# Altium schematic sheet JETSON AGX NVHS.SchDoc: Jetson AGX -NVHS
size 431 x 279 mm; CheckedBy: Lance Bantoto; DocumentNumber: 5; Revision: 1; SheetNumber: 5; SheetTotal: 23
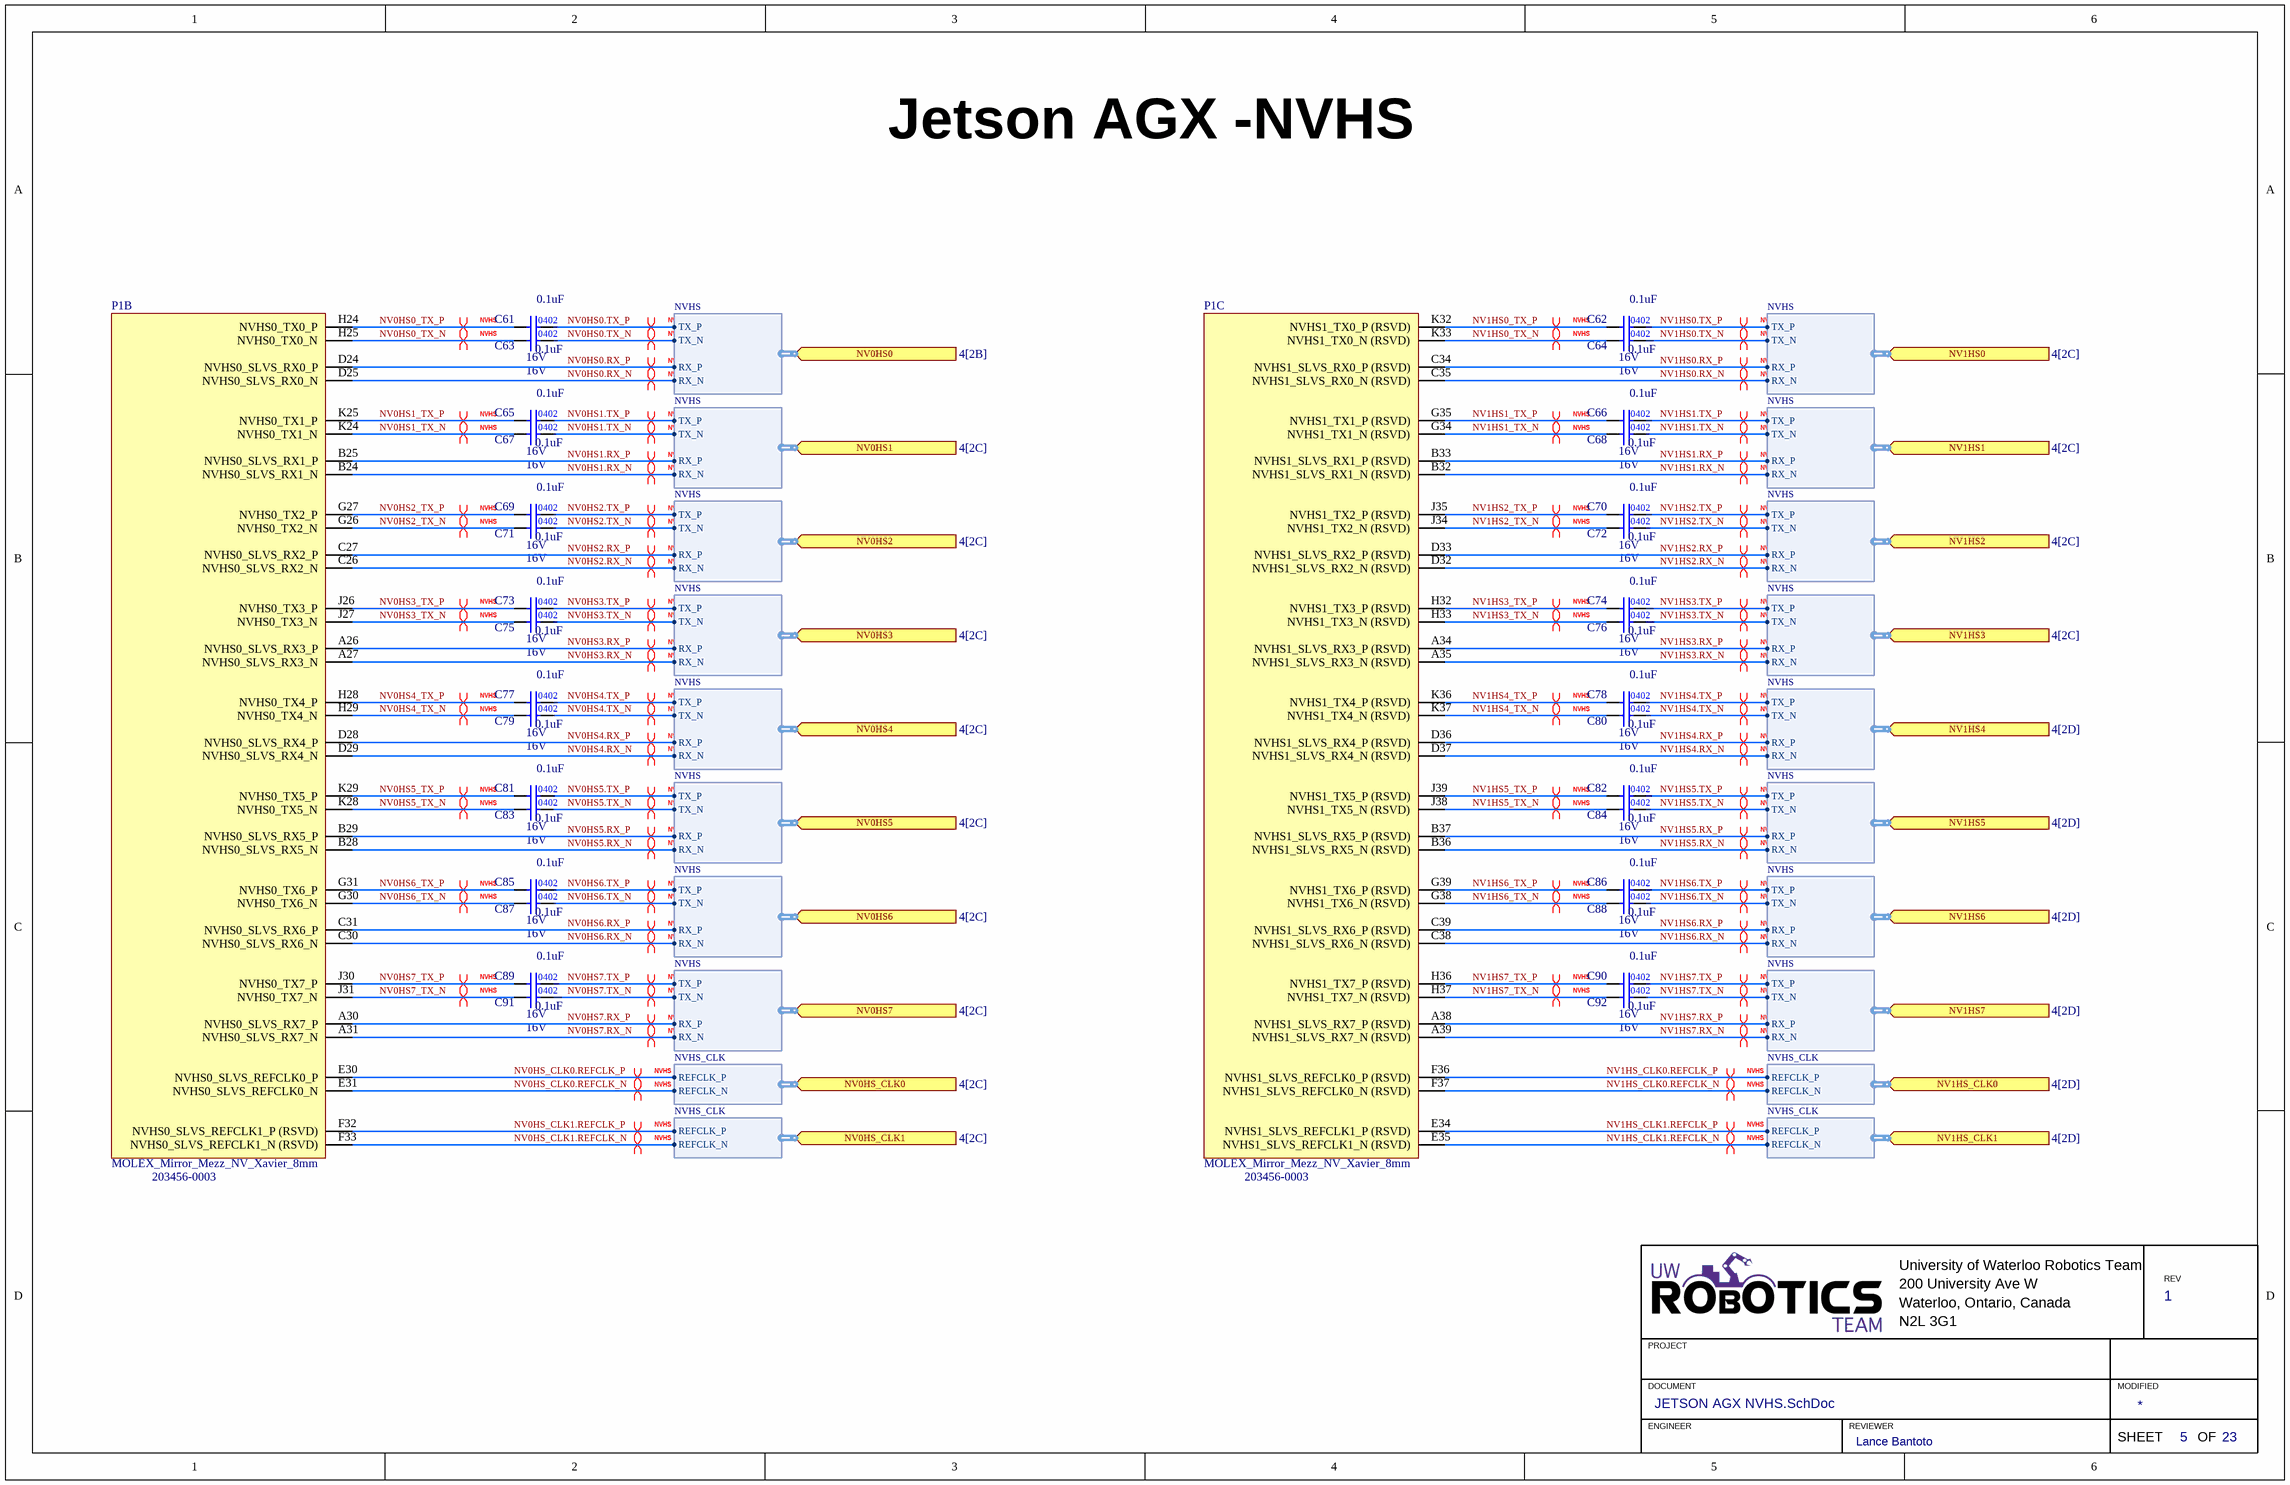
[diagram p0: JETSON AGX NVHS.SchDoc]

## Parts
C61  Capacitance: 0.1uF  Voltage Rating: 16V  [CAP0402]  (hidden comment: CAP_0.1uF_16V_X7R_0402)
C62  Capacitance: 0.1uF  Voltage Rating: 16V  [CAP0402]  (hidden comment: CAP_0.1uF_16V_X7R_0402)
C63  Capacitance: 0.1uF  Voltage Rating: 16V  [CAP0402]  (hidden comment: CAP_0.1uF_16V_X7R_0402)
C64  Capacitance: 0.1uF  Voltage Rating: 16V  [CAP0402]  (hidden comment: CAP_0.1uF_16V_X7R_0402)
C65  Capacitance: 0.1uF  Voltage Rating: 16V  [CAP0402]  (hidden comment: CAP_0.1uF_16V_X7R_0402)
C66  Capacitance: 0.1uF  Voltage Rating: 16V  [CAP0402]  (hidden comment: CAP_0.1uF_16V_X7R_0402)
C67  Capacitance: 0.1uF  Voltage Rating: 16V  [CAP0402]  (hidden comment: CAP_0.1uF_16V_X7R_0402)
C68  Capacitance: 0.1uF  Voltage Rating: 16V  [CAP0402]  (hidden comment: CAP_0.1uF_16V_X7R_0402)
C69  Capacitance: 0.1uF  Voltage Rating: 16V  [CAP0402]  (hidden comment: CAP_0.1uF_16V_X7R_0402)
C70  Capacitance: 0.1uF  Voltage Rating: 16V  [CAP0402]  (hidden comment: CAP_0.1uF_16V_X7R_0402)
C71  Capacitance: 0.1uF  Voltage Rating: 16V  [CAP0402]  (hidden comment: CAP_0.1uF_16V_X7R_0402)
C72  Capacitance: 0.1uF  Voltage Rating: 16V  [CAP0402]  (hidden comment: CAP_0.1uF_16V_X7R_0402)
C73  Capacitance: 0.1uF  Voltage Rating: 16V  [CAP0402]  (hidden comment: CAP_0.1uF_16V_X7R_0402)
C74  Capacitance: 0.1uF  Voltage Rating: 16V  [CAP0402]  (hidden comment: CAP_0.1uF_16V_X7R_0402)
C75  Capacitance: 0.1uF  Voltage Rating: 16V  [CAP0402]  (hidden comment: CAP_0.1uF_16V_X7R_0402)
C76  Capacitance: 0.1uF  Voltage Rating: 16V  [CAP0402]  (hidden comment: CAP_0.1uF_16V_X7R_0402)
C77  Capacitance: 0.1uF  Voltage Rating: 16V  [CAP0402]  (hidden comment: CAP_0.1uF_16V_X7R_0402)
C78  Capacitance: 0.1uF  Voltage Rating: 16V  [CAP0402]  (hidden comment: CAP_0.1uF_16V_X7R_0402)
C79  Capacitance: 0.1uF  Voltage Rating: 16V  [CAP0402]  (hidden comment: CAP_0.1uF_16V_X7R_0402)
C80  Capacitance: 0.1uF  Voltage Rating: 16V  [CAP0402]  (hidden comment: CAP_0.1uF_16V_X7R_0402)
C81  Capacitance: 0.1uF  Voltage Rating: 16V  [CAP0402]  (hidden comment: CAP_0.1uF_16V_X7R_0402)
C82  Capacitance: 0.1uF  Voltage Rating: 16V  [CAP0402]  (hidden comment: CAP_0.1uF_16V_X7R_0402)
C83  Capacitance: 0.1uF  Voltage Rating: 16V  [CAP0402]  (hidden comment: CAP_0.1uF_16V_X7R_0402)
C84  Capacitance: 0.1uF  Voltage Rating: 16V  [CAP0402]  (hidden comment: CAP_0.1uF_16V_X7R_0402)
C85  Capacitance: 0.1uF  Voltage Rating: 16V  [CAP0402]  (hidden comment: CAP_0.1uF_16V_X7R_0402)
C86  Capacitance: 0.1uF  Voltage Rating: 16V  [CAP0402]  (hidden comment: CAP_0.1uF_16V_X7R_0402)
C87  Capacitance: 0.1uF  Voltage Rating: 16V  [CAP0402]  (hidden comment: CAP_0.1uF_16V_X7R_0402)
C88  Capacitance: 0.1uF  Voltage Rating: 16V  [CAP0402]  (hidden comment: CAP_0.1uF_16V_X7R_0402)
C89  Capacitance: 0.1uF  Voltage Rating: 16V  [CAP0402]  (hidden comment: CAP_0.1uF_16V_X7R_0402)
C90  Capacitance: 0.1uF  Voltage Rating: 16V  [CAP0402]  (hidden comment: CAP_0.1uF_16V_X7R_0402)
C91  Capacitance: 0.1uF  Voltage Rating: 16V  [CAP0402]  (hidden comment: CAP_0.1uF_16V_X7R_0402)
C92  Capacitance: 0.1uF  Voltage Rating: 16V  [CAP0402]  (hidden comment: CAP_0.1uF_16V_X7R_0402)
P1  MOLEX_Mirror_Mezz_NV_Xavier_8mm  [203456-0003]  (parts B,C of 15)

## Ports
NV0HS0 (in, harness NVHS, see 4[2B]), NV0HS1 (in, harness NVHS, see 4[2C]), NV0HS2 (in, harness NVHS, see 4[2C]), NV0HS3 (in, harness NVHS, see 4[2C]), NV0HS4 (in, harness NVHS, see 4[2C]), NV0HS5 (in, harness NVHS, see 4[2C]), NV0HS6 (in, harness NVHS, see 4[2C]), NV0HS7 (in, harness NVHS, see 4[2C]), NV0HS_CLK0 (in, harness NVHS_CLK, see 4[2C]), NV0HS_CLK1 (in, harness NVHS_CLK, see 4[2C]), NV1HS0 (in, harness NVHS, see 4[2C]), NV1HS1 (in, harness NVHS, see 4[2C]), NV1HS2 (in, harness NVHS, see 4[2C]), NV1HS3 (in, harness NVHS, see 4[2C]), NV1HS4 (in, harness NVHS, see 4[2D]), NV1HS5 (in, harness NVHS, see 4[2D]), NV1HS6 (in, harness NVHS, see 4[2D]), NV1HS7 (in, harness NVHS, see 4[2D]), NV1HS_CLK0 (in, harness NVHS_CLK, see 4[2D]), NV1HS_CLK1 (in, harness NVHS_CLK, see 4[2D])

## Harnesses
NVHS: TX_P, TX_N, RX_P, RX_N
NVHS_CLK: REFCLK_P, REFCLK_N

## Nets
NV0HS0.RX_N: P1.D25(NVHS0_SLVS_RX0_N) ; port NV0HS0.RX_N
NV0HS0.RX_P: P1.D24(NVHS0_SLVS_RX0_P) ; port NV0HS0.RX_P
NV0HS0.TX_N: C63.2 ; port NV0HS0.TX_N
NV0HS0.TX_P: C61.2 ; port NV0HS0.TX_P
NV0HS0_TX_N: C63.1 P1.H25(NVHS0_TX0_N)
NV0HS0_TX_P: C61.1 P1.H24(NVHS0_TX0_P)
NV0HS1.RX_N: P1.B24(NVHS0_SLVS_RX1_N) ; port NV0HS1.RX_N
NV0HS1.RX_P: P1.B25(NVHS0_SLVS_RX1_P) ; port NV0HS1.RX_P
NV0HS1.TX_N: C67.2 ; port NV0HS1.TX_N
NV0HS1.TX_P: C65.2 ; port NV0HS1.TX_P
NV0HS1_TX_N: C67.1 P1.K24(NVHS0_TX1_N)
NV0HS1_TX_P: C65.1 P1.K25(NVHS0_TX1_P)
NV0HS2.RX_N: P1.C26(NVHS0_SLVS_RX2_N) ; port NV0HS2.RX_N
NV0HS2.RX_P: P1.C27(NVHS0_SLVS_RX2_P) ; port NV0HS2.RX_P
NV0HS2.TX_N: C71.2 ; port NV0HS2.TX_N
NV0HS2.TX_P: C69.2 ; port NV0HS2.TX_P
NV0HS2_TX_N: C71.1 P1.G26(NVHS0_TX2_N)
NV0HS2_TX_P: C69.1 P1.G27(NVHS0_TX2_P)
NV0HS3.RX_N: P1.A27(NVHS0_SLVS_RX3_N) ; port NV0HS3.RX_N
NV0HS3.RX_P: P1.A26(NVHS0_SLVS_RX3_P) ; port NV0HS3.RX_P
NV0HS3.TX_N: C75.2 ; port NV0HS3.TX_N
NV0HS3.TX_P: C73.2 ; port NV0HS3.TX_P
NV0HS3_TX_N: C75.1 P1.J27(NVHS0_TX3_N)
NV0HS3_TX_P: C73.1 P1.J26(NVHS0_TX3_P)
NV0HS4.RX_N: P1.D29(NVHS0_SLVS_RX4_N) ; port NV0HS4.RX_N
NV0HS4.RX_P: P1.D28(NVHS0_SLVS_RX4_P) ; port NV0HS4.RX_P
NV0HS4.TX_N: C79.2 ; port NV0HS4.TX_N
NV0HS4.TX_P: C77.2 ; port NV0HS4.TX_P
NV0HS4_TX_N: C79.1 P1.H29(NVHS0_TX4_N)
NV0HS4_TX_P: C77.1 P1.H28(NVHS0_TX4_P)
NV0HS5.RX_N: P1.B28(NVHS0_SLVS_RX5_N) ; port NV0HS5.RX_N
NV0HS5.RX_P: P1.B29(NVHS0_SLVS_RX5_P) ; port NV0HS5.RX_P
NV0HS5.TX_N: C83.2 ; port NV0HS5.TX_N
NV0HS5.TX_P: C81.2 ; port NV0HS5.TX_P
NV0HS5_TX_N: C83.1 P1.K28(NVHS0_TX5_N)
NV0HS5_TX_P: C81.1 P1.K29(NVHS0_TX5_P)
NV0HS6.RX_N: P1.C30(NVHS0_SLVS_RX6_N) ; port NV0HS6.RX_N
NV0HS6.RX_P: P1.C31(NVHS0_SLVS_RX6_P) ; port NV0HS6.RX_P
NV0HS6.TX_N: C87.2 ; port NV0HS6.TX_N
NV0HS6.TX_P: C85.2 ; port NV0HS6.TX_P
NV0HS6_TX_N: C87.1 P1.G30(NVHS0_TX6_N)
NV0HS6_TX_P: C85.1 P1.G31(NVHS0_TX6_P)
NV0HS7.RX_N: P1.A31(NVHS0_SLVS_RX7_N) ; port NV0HS7.RX_N
NV0HS7.RX_P: P1.A30(NVHS0_SLVS_RX7_P) ; port NV0HS7.RX_P
NV0HS7.TX_N: C91.2 ; port NV0HS7.TX_N
NV0HS7.TX_P: C89.2 ; port NV0HS7.TX_P
NV0HS7_TX_N: C91.1 P1.J31(NVHS0_TX7_N)
NV0HS7_TX_P: C89.1 P1.J30(NVHS0_TX7_P)
NV0HS_CLK0.REFCLK_N: P1.E31(NVHS0_SLVS_REFCLK0_N) ; port NV0HS_CLK0.REFCLK_N
NV0HS_CLK0.REFCLK_P: P1.E30(NVHS0_SLVS_REFCLK0_P) ; port NV0HS_CLK0.REFCLK_P
NV0HS_CLK1.REFCLK_N: P1.F33(NVHS0_SLVS_REFCLK1_N_(RSVD)) ; port NV0HS_CLK1.REFCLK_N
NV0HS_CLK1.REFCLK_P: P1.F32(NVHS0_SLVS_REFCLK1_P_(RSVD)) ; port NV0HS_CLK1.REFCLK_P
NV1HS0.RX_N: P1.C35(NVHS1_SLVS_RX0_N_(RSVD)) ; port NV1HS0.RX_N
NV1HS0.RX_P: P1.C34(NVHS1_SLVS_RX0_P_(RSVD)) ; port NV1HS0.RX_P
NV1HS0.TX_N: C64.2 ; port NV1HS0.TX_N
NV1HS0.TX_P: C62.2 ; port NV1HS0.TX_P
NV1HS0_TX_N: C64.1 P1.K33(NVHS1_TX0_N_(RSVD))
NV1HS0_TX_P: C62.1 P1.K32(NVHS1_TX0_P_(RSVD))
NV1HS1.RX_N: P1.B32(NVHS1_SLVS_RX1_N_(RSVD)) ; port NV1HS1.RX_N
NV1HS1.RX_P: P1.B33(NVHS1_SLVS_RX1_P_(RSVD)) ; port NV1HS1.RX_P
NV1HS1.TX_N: C68.2 ; port NV1HS1.TX_N
NV1HS1.TX_P: C66.2 ; port NV1HS1.TX_P
NV1HS1_TX_N: C68.1 P1.G34(NVHS1_TX1_N_(RSVD))
NV1HS1_TX_P: C66.1 P1.G35(NVHS1_TX1_P_(RSVD))
NV1HS2.RX_N: P1.D32(NVHS1_SLVS_RX2_N_(RSVD)) ; port NV1HS2.RX_N
NV1HS2.RX_P: P1.D33(NVHS1_SLVS_RX2_P_(RSVD)) ; port NV1HS2.RX_P
NV1HS2.TX_N: C72.2 ; port NV1HS2.TX_N
NV1HS2.TX_P: C70.2 ; port NV1HS2.TX_P
NV1HS2_TX_N: C72.1 P1.J34(NVHS1_TX2_N_(RSVD))
NV1HS2_TX_P: C70.1 P1.J35(NVHS1_TX2_P_(RSVD))
NV1HS3.RX_N: P1.A35(NVHS1_SLVS_RX3_N_(RSVD)) ; port NV1HS3.RX_N
NV1HS3.RX_P: P1.A34(NVHS1_SLVS_RX3_P_(RSVD)) ; port NV1HS3.RX_P
NV1HS3.TX_N: C76.2 ; port NV1HS3.TX_N
NV1HS3.TX_P: C74.2 ; port NV1HS3.TX_P
NV1HS3_TX_N: C76.1 P1.H33(NVHS1_TX3_N_(RSVD))
NV1HS3_TX_P: C74.1 P1.H32(NVHS1_TX3_P_(RSVD))
NV1HS4.RX_N: P1.D37(NVHS1_SLVS_RX4_N_(RSVD)) ; port NV1HS4.RX_N
NV1HS4.RX_P: P1.D36(NVHS1_SLVS_RX4_P_(RSVD)) ; port NV1HS4.RX_P
NV1HS4.TX_N: C80.2 ; port NV1HS4.TX_N
NV1HS4.TX_P: C78.2 ; port NV1HS4.TX_P
NV1HS4_TX_N: C80.1 P1.K37(NVHS1_TX4_N_(RSVD))
NV1HS4_TX_P: C78.1 P1.K36(NVHS1_TX4_P_(RSVD))
NV1HS5.RX_N: P1.B36(NVHS1_SLVS_RX5_N_(RSVD)) ; port NV1HS5.RX_N
NV1HS5.RX_P: P1.B37(NVHS1_SLVS_RX5_P_(RSVD)) ; port NV1HS5.RX_P
NV1HS5.TX_N: C84.2 ; port NV1HS5.TX_N
NV1HS5.TX_P: C82.2 ; port NV1HS5.TX_P
NV1HS5_TX_N: C84.1 P1.J38(NVHS1_TX5_N_(RSVD))
NV1HS5_TX_P: C82.1 P1.J39(NVHS1_TX5_P_(RSVD))
NV1HS6.RX_N: P1.C38(NVHS1_SLVS_RX6_N_(RSVD)) ; port NV1HS6.RX_N
NV1HS6.RX_P: P1.C39(NVHS1_SLVS_RX6_P_(RSVD)) ; port NV1HS6.RX_P
NV1HS6.TX_N: C88.2 ; port NV1HS6.TX_N
NV1HS6.TX_P: C86.2 ; port NV1HS6.TX_P
NV1HS6_TX_N: C88.1 P1.G38(NVHS1_TX6_N_(RSVD))
NV1HS6_TX_P: C86.1 P1.G39(NVHS1_TX6_P_(RSVD))
NV1HS7.RX_N: P1.A39(NVHS1_SLVS_RX7_N_(RSVD)) ; port NV1HS7.RX_N
NV1HS7.RX_P: P1.A38(NVHS1_SLVS_RX7_P_(RSVD)) ; port NV1HS7.RX_P
NV1HS7.TX_N: C92.2 ; port NV1HS7.TX_N
NV1HS7.TX_P: C90.2 ; port NV1HS7.TX_P
NV1HS7_TX_N: C92.1 P1.H37(NVHS1_TX7_N_(RSVD))
NV1HS7_TX_P: C90.1 P1.H36(NVHS1_TX7_P_(RSVD))
NV1HS_CLK0.REFCLK_N: P1.F37(NVHS1_SLVS_REFCLK0_N_(RSVD)) ; port NV1HS_CLK0.REFCLK_N
NV1HS_CLK0.REFCLK_P: P1.F36(NVHS1_SLVS_REFCLK0_P_(RSVD)) ; port NV1HS_CLK0.REFCLK_P
NV1HS_CLK1.REFCLK_N: P1.E35(NVHS1_SLVS_REFCLK1_N_(RSVD)) ; port NV1HS_CLK1.REFCLK_N
NV1HS_CLK1.REFCLK_P: P1.E34(NVHS1_SLVS_REFCLK1_P_(RSVD)) ; port NV1HS_CLK1.REFCLK_P

## Layout directives
differential pair; differential pair class NVHS; differential pair class NV0HS_CLK0; differential pair class NVHS_CLK: NV0HS_CLK0.REFCLK_N, NV0HS_CLK0.REFCLK_P
differential pair; differential pair class NVHS; differential pair class NV0HS_CLK1; differential pair class NVHS_CLK: NV0HS_CLK1.REFCLK_N, NV0HS_CLK1.REFCLK_P
differential pair; differential pair class NVHS; differential pair class NV1HS_CLK0; differential pair class NVHS_CLK: NV1HS_CLK0.REFCLK_N, NV1HS_CLK0.REFCLK_P
differential pair; differential pair class NVHS; differential pair class NV1HS_CLK1; differential pair class NVHS_CLK: NV1HS_CLK1.REFCLK_N, NV1HS_CLK1.REFCLK_P
differential pair; differential pair class NVHS; differential pair class NV0HS0: NV0HS0.RX_N, NV0HS0.RX_P, NV0HS0.TX_N, NV0HS0.TX_P, NV0HS0_TX_N, NV0HS0_TX_P
differential pair; differential pair class NVHS; differential pair class NV0HS1: NV0HS1.RX_N, NV0HS1.RX_P, NV0HS1.TX_N, NV0HS1.TX_P, NV0HS1_TX_N, NV0HS1_TX_P
differential pair; differential pair class NVHS; differential pair class NV0HS2: NV0HS2.RX_N, NV0HS2.RX_P, NV0HS2.TX_N, NV0HS2.TX_P, NV0HS2_TX_N, NV0HS2_TX_P
differential pair; differential pair class NVHS; differential pair class NV0HS3: NV0HS3.RX_N, NV0HS3.RX_P, NV0HS3.TX_N, NV0HS3.TX_P, NV0HS3_TX_N, NV0HS3_TX_P
differential pair; differential pair class NVHS; differential pair class NV0HS4: NV0HS4.RX_N, NV0HS4.RX_P, NV0HS4.TX_N, NV0HS4.TX_P, NV0HS4_TX_N, NV0HS4_TX_P
differential pair; differential pair class NVHS; differential pair class NV0HS5: NV0HS5.RX_N, NV0HS5.RX_P, NV0HS5.TX_N, NV0HS5.TX_P, NV0HS5_TX_N, NV0HS5_TX_P
differential pair; differential pair class NVHS; differential pair class NV0HS6: NV0HS6.RX_N, NV0HS6.RX_P, NV0HS6.TX_N, NV0HS6.TX_P, NV0HS6_TX_N, NV0HS6_TX_P
differential pair; differential pair class NVHS; differential pair class NV0HS7: NV0HS7.RX_N, NV0HS7.RX_P, NV0HS7.TX_N, NV0HS7.TX_P, NV0HS7_TX_N, NV0HS7_TX_P
differential pair; differential pair class NVHS; differential pair class NV1HS0: NV1HS0.RX_N, NV1HS0.RX_P, NV1HS0.TX_N, NV1HS0.TX_P, NV1HS0_TX_N, NV1HS0_TX_P
differential pair; differential pair class NVHS; differential pair class NV1HS1: NV1HS1.RX_N, NV1HS1.RX_P, NV1HS1.TX_N, NV1HS1.TX_P, NV1HS1_TX_N, NV1HS1_TX_P
differential pair; differential pair class NVHS; differential pair class NV1HS2: NV1HS2.RX_N, NV1HS2.RX_P, NV1HS2.TX_N, NV1HS2.TX_P, NV1HS2_TX_N, NV1HS2_TX_P
differential pair; differential pair class NVHS; differential pair class NV1HS3: NV1HS3.RX_N, NV1HS3.RX_P, NV1HS3.TX_N, NV1HS3.TX_P, NV1HS3_TX_N, NV1HS3_TX_P
differential pair; differential pair class NVHS; differential pair class NV1HS4: NV1HS4.RX_N, NV1HS4.RX_P, NV1HS4.TX_N, NV1HS4.TX_P, NV1HS4_TX_N, NV1HS4_TX_P
differential pair; differential pair class NVHS; differential pair class NV1HS5: NV1HS5.RX_N, NV1HS5.RX_P, NV1HS5.TX_N, NV1HS5.TX_P, NV1HS5_TX_N, NV1HS5_TX_P
differential pair; differential pair class NVHS; differential pair class NV1HS6: NV1HS6.RX_N, NV1HS6.RX_P, NV1HS6.TX_N, NV1HS6.TX_P, NV1HS6_TX_N, NV1HS6_TX_P
differential pair; differential pair class NVHS; differential pair class NV1HS7: NV1HS7.RX_N, NV1HS7.RX_P, NV1HS7.TX_N, NV1HS7.TX_P, NV1HS7_TX_N, NV1HS7_TX_P

## Notes on the sheet
- University of Waterloo Robotics Team
- 200 University Ave W
- REV
- PROJECT
- Waterloo, Ontario, Canada
- N2L 3G1
- DOCUMENT
- ENGINEER
- REVIEWER
- MODIFIED
- SHEET
- OF

## Library data of the parts
C61-C92 = CAP_0.1uF_16V_X7R_0402: CAP CER 0.1UF 16V X7R 0402; Supplier 1: Digi-Key; Mounting Type: Surface Mount; Package: 0402
P1 = MOLEX_Mirror_Mezz_NV_Xavier_8mm: CONN SELF-MATE 699POS SMD GOLD; Manufacturer 1: Molex; Supplier 1: Digi-Key; Supplier Part Number 1: WM25528CT-ND; Manufacturer Part Number 1: 203456-0003